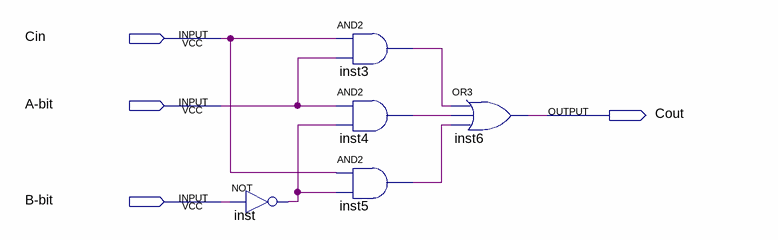
[diagram p0: schematic sheet]
// Quartus schematic comparadorBit-Bit.bdf as structural Verilog: 5 symbols, 4 pins
module \comparadorBit-Bit  (
  input  Cin,
  input  \A-bit ,
  input  \B-bit ,
  output Cout
);

  wire inst3_out, inst4_out, inst5_out, inst_out;

  not inst (inst_out, \B-bit );
  and inst3 (inst3_out, Cin, \A-bit );
  and inst4 (inst4_out, \A-bit , inst_out);
  and inst5 (inst5_out, Cin, inst_out);
  or inst6 (Cout, inst3_out, inst4_out, inst5_out);
endmodule
